# EAGLE design NanoPi_NEO_Adapter_V1.0 (EAGLE 6.6.0)
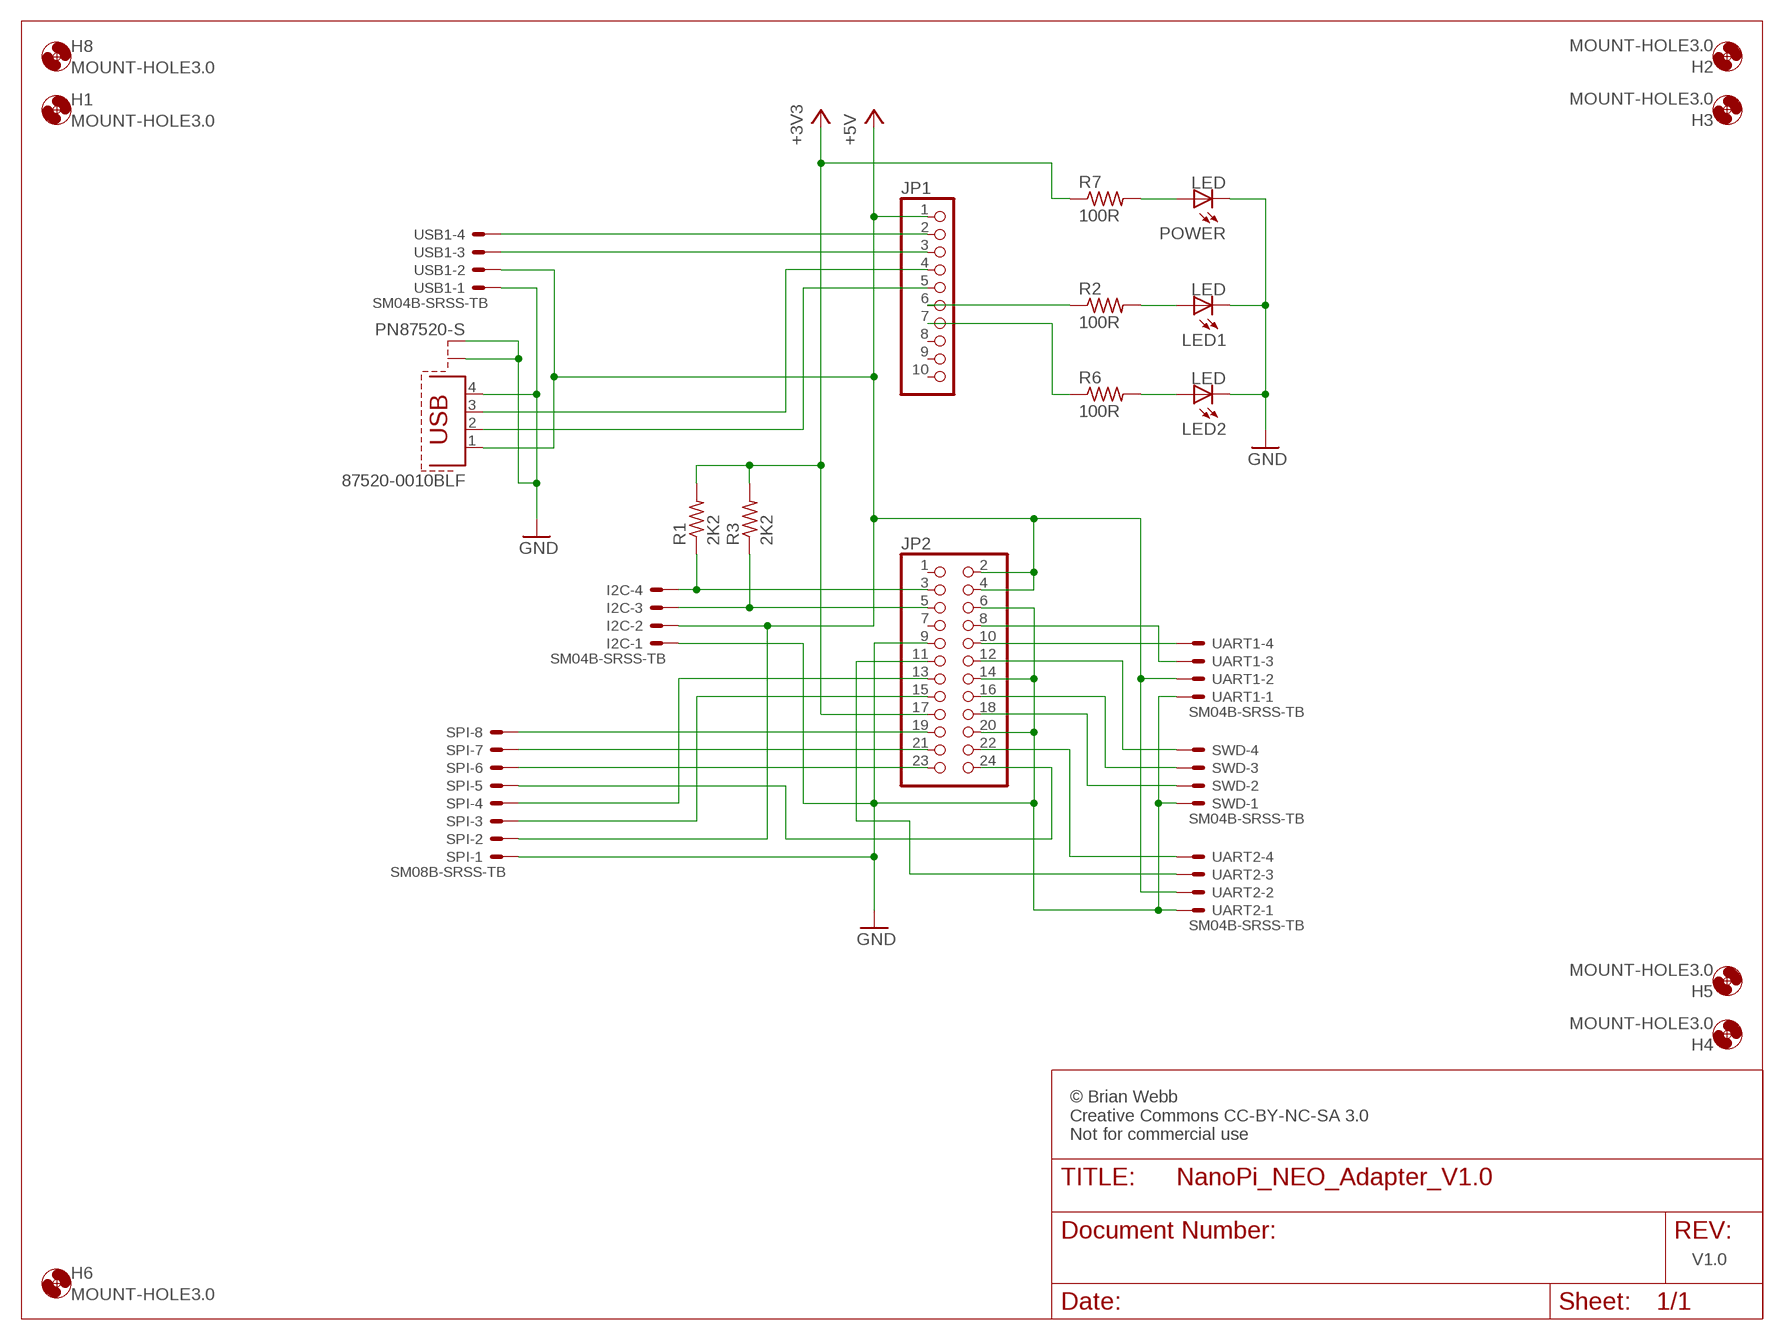
[diagram p0: schematic, sheet 1]

## Parts
87520-0010BLF  PN87520-S  [PN87520-S]
H1  MOUNT-HOLE3.0  [3,0]
H2  MOUNT-HOLE3.0  [3,0]
H3  MOUNT-HOLE3.0  [3,0]
H4  MOUNT-HOLE3.0  [3,0]
H5  MOUNT-HOLE3.0  [3,0]
H6  MOUNT-HOLE3.0  [3,0]
H8  MOUNT-HOLE3.0  [3,0]
I2C  SM04B-SRSS-TB  [SM04B-SRSS-TB]
JP1  PINHD-1X10  [1X10]
JP2  PINHD-2X12  [2X12]
LED1  LED  LED_0402  [LED0402]
LED2  LED  LED_0402  [LED0402]
POWER  LED  LED_0402  [LED0402]
R1  2K2  R-US_R0402  [R0402]
R2  100R  R-US_R0402  [R0402]
R3  2K2  R-US_R0402  [R0402]
R6  100R  R-US_R0402  [R0402]
R7  100R  R-US_R0402  [R0402]
SPI  SM08B-SRSS-TB  [SM08B-SRSS-TB]
SWD  SM04B-SRSS-TB  [SM04B-SRSS-TB]
UART1  SM04B-SRSS-TB  [SM04B-SRSS-TB]
UART2  SM04B-SRSS-TB  [SM04B-SRSS-TB]
USB1  SM04B-SRSS-TB  [SM04B-SRSS-TB]

## Nets
+3V3: JP2.17 R1.2 R3.2 R7.1
+5V: 87520-0010BLF.1 I2C.2 JP1.1 JP2.2 JP2.4 SPI.2 UART1.2 UART2.2 USB1.2
GND: 87520-0010BLF.4 87520-0010BLF.S1 87520-0010BLF.S2 I2C.1 JP2.6 JP2.9 JP2.14 JP2.20 LED1.C LED2.C POWER.C SPI.1 SWD.1 UART1.1 UART2.1 USB1.1
N$1: JP1.2 USB1.4
N$2: JP1.3 USB1.3
N$3: JP2.10 UART1.4
N$4: JP2.8 UART1.3
N$5: 87520-0010BLF.3 JP1.4
N$6: 87520-0010BLF.2 JP1.5
N$7: JP2.19 SPI.8
N$8: JP2.22 UART2.4
N$9: JP2.18 SWD.2
N$10: I2C.4 JP2.3 R1.1
N$11: I2C.3 JP2.5 R3.1
N$12: JP2.21 SPI.7
N$13: JP2.23 SPI.6
N$14: JP2.24 SPI.5
N$15: JP2.13 SPI.4
N$16: JP2.15 SPI.3
N$17: LED2.A R6.2
N$18: LED1.A R2.2
N$19: POWER.A R7.2
N$20: JP2.11 UART2.3
N$21: JP1.6 R2.1
N$22: JP1.7 R6.1
N$23: JP2.16 SWD.3
N$24: JP2.12 SWD.4
Unconnected: JP1.8 JP1.9 JP1.10 JP2.1 JP2.7

## Notes on the sheet
- © Brian Webb
  Creative Commons CC-BY-NC-SA 3.0
  Not for commercial use
- V1.0

## Library data of the parts
87520-0010BLF = con-berg:PN87520-S; OC_FARNELL: unknown; OC_NEWARK: unknown
H1-H6 H8 = webb:MOUNT-HOLE: MOUNTING HOLE with drill center marker
I2C SWD UART1 UART2 USB1 = con-jst2:?M04B-SRSS-TB: Disconnectable Crimp style connector, 1.0mm pitch 4 contacts
JP1 = pinhead:PINHD-1X10: PIN HEADER
JP2 = pinhead:PINHD-2X12: PIN HEADER
LED1 LED2 POWER = webb:LED_0402
R1-R3 R6 R7 = rcl:R-US_: RESISTOR, American symbol; PARTNO: ERJ-2GEJ222X
SPI = con-jst2:?M08B-SRSS-TB: Disconnectable Crimp style connector, 1.0mm pitch 8 contacts

## Net classes
0 default: width 0.152 mm, clearance 0.152 mm
1 power: width 0.254 mm, clearance 0.152 mm

## Board
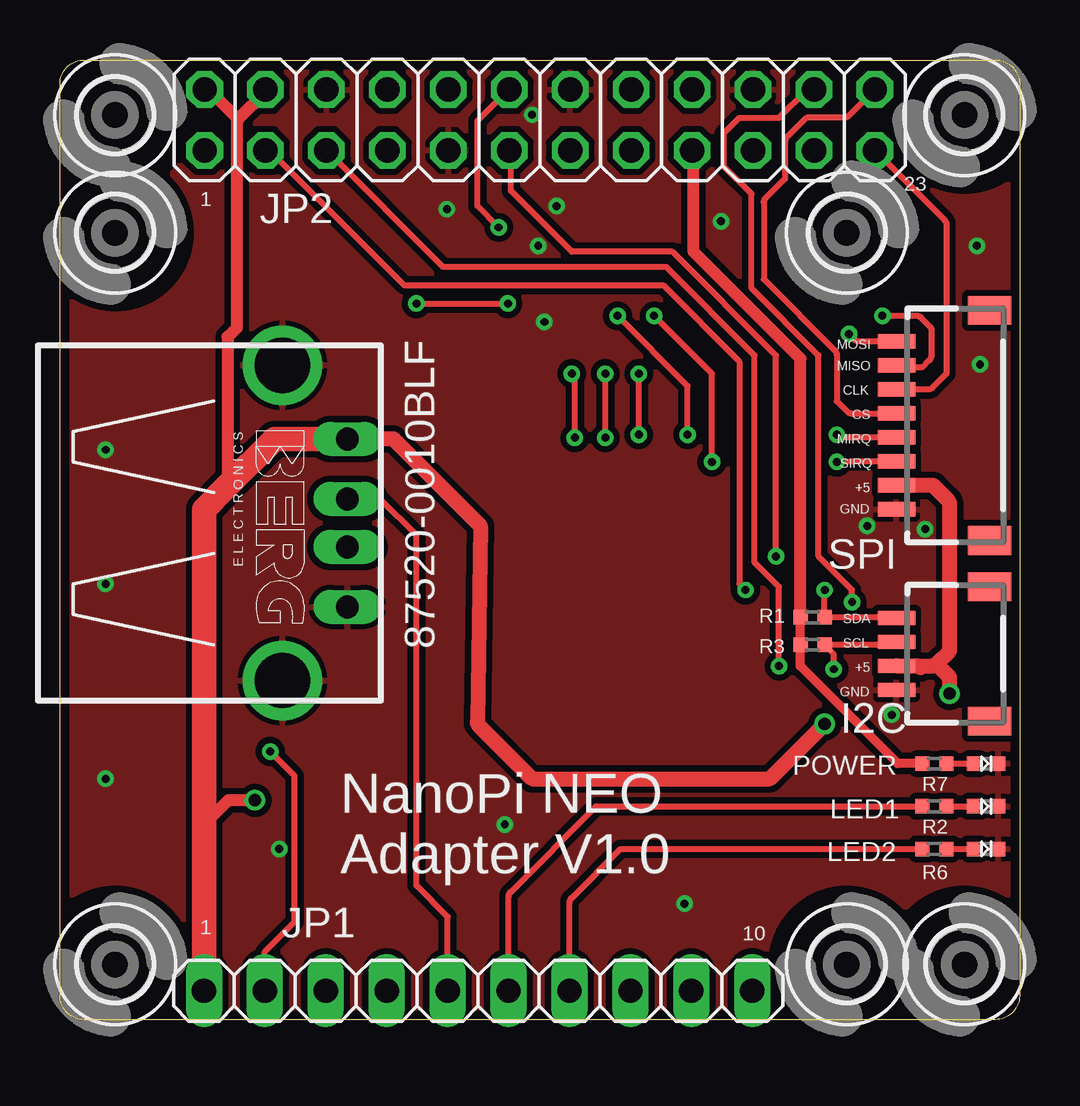
[diagram p1: board, top side]
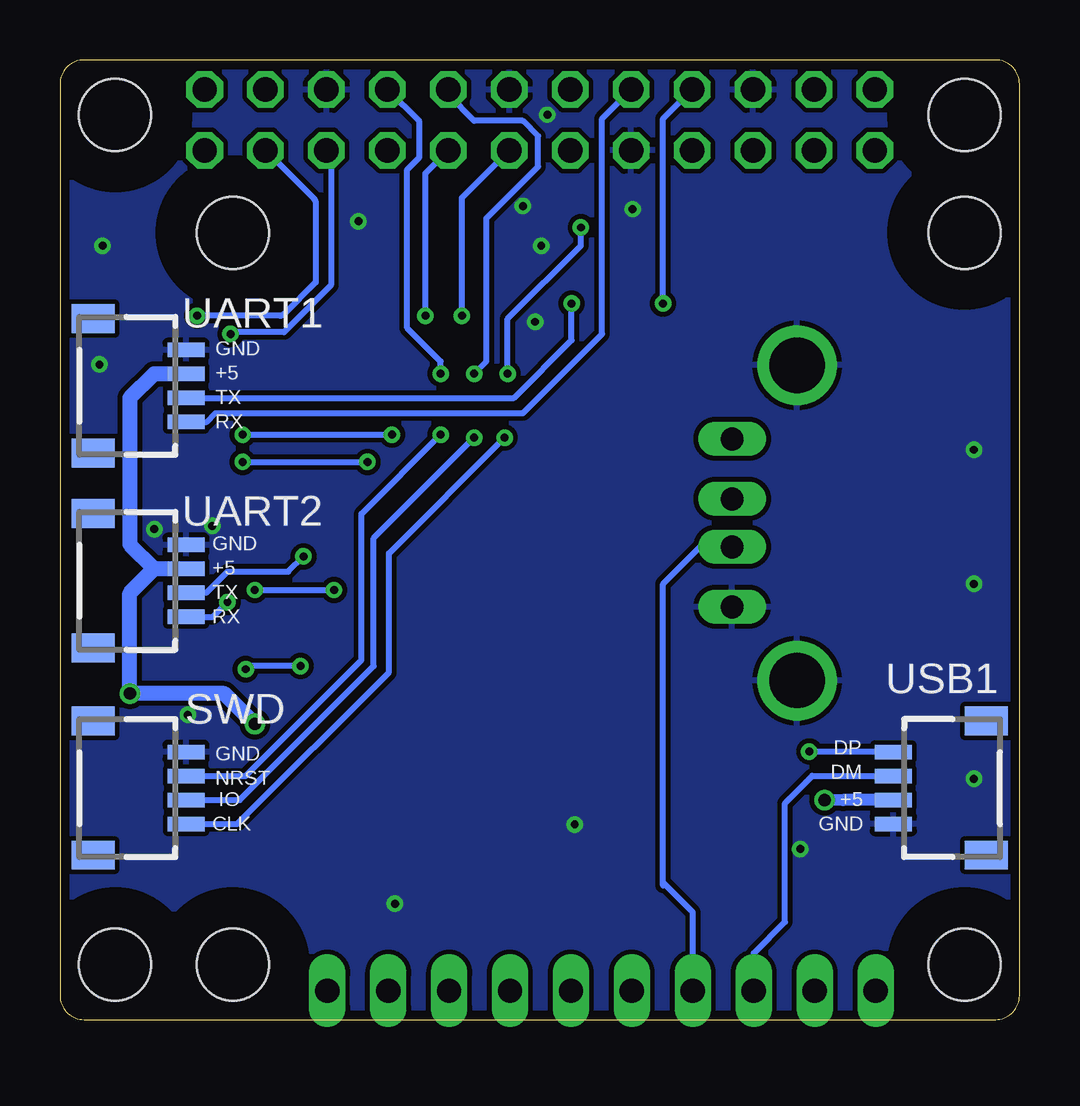
[diagram p2: board, bottom side, seen from below]

Size 40 x 40 mm. Coordinates in mm from the lower left corner, seen from the top.
Outline: 0,1 0,39 arc-90 1,40 39,40 arc-90 40,39 40,1 arc-90 39,0 1,0 arc-90 0,1
Copper layers (1*16): Top 0.0356mm / dielectric 1.5011mm / Bottom 0.0356mm
Design rules "LaenPCBOrder *": minimum track width 6mil, minimum drill 13mil, track to track 6mil, track to pad 6mil, pad to pad 6mil, via to via 6mil, smd to smd 6mil, copper to edge 15mil, drill to drill 6mil, minimum pad ring 7mil, minimum via ring 7mil, stop-mask expansion 4mil, vias tented up to drill 30mil, thermal gap 8mil

### Footprints (pad centres in the part's own frame; a part is rotated, then mirrored left to right if it is on the bottom)
PN87520-S = drill 0.95 long: 1 -3.5,2.71; 2 -1,2.71; 3 1,2.71; 4 3.5,2.71 | drill 2.3 pad 2.9: S1 -6.57,0; S2 6.57,0
3,0 = hole 3: 0,0
SM04B-SRSS-TB = smd 0.6 x 1.55: 1 -1.5,2.975; 2 -0.5,2.975; 3 0.5,2.975; 4 1.5,2.975 | smd 1.2 x 1.8: FIT@1 -2.8,-0.9; FIT@2 2.8,-0.9
1X10 = drill 1.016 long: 1 -11.43,0; 2 -8.89,0; 3 -6.35,0; 4 -3.81,0; 5 -1.27,0; 6 1.27,0; 7 3.81,0; 8 6.35,0; 9 8.89,0; 10 11.43,0
2X12 = drill 1.016 octagon: 1 -13.97,-1.27; 2 -13.97,1.27; 3 -11.43,-1.27; 4 -11.43,1.27; 5 -8.89,-1.27; 6 -8.89,1.27; 7 -6.35,-1.27; 8 -6.35,1.27; 9 -3.81,-1.27; 10 -3.81,1.27; 11 -1.27,-1.27; 12 -1.27,1.27; 13 1.27,-1.27; 14 1.27,1.27; 15 3.81,-1.27; 16 3.81,1.27; 17 6.35,-1.27; 18 6.35,1.27; 19 8.89,-1.27; 20 8.89,1.27; 21 11.43,-1.27; 22 11.43,1.27; 23 13.97,-1.27; 24 13.97,1.27
LED0402 = smd 0.6 x 0.6: A -0.5,0; C 0.5,0
R0402 = smd 0.6 x 0.6: 1 -0.5,0; 2 0.5,0
SM08B-SRSS-TB = smd 0.6 x 1.55: 1 -3.5,2.975; 2 -2.5,2.975; 3 -1.5,2.975; 4 -0.5,2.975; 5 0.5,2.975; 6 1.5,2.975; 7 2.5,2.975; 8 3.5,2.975 | smd 1.2 x 1.8: FIT@1 -4.8,-0.9; FIT@2 4.8,-0.9

### Placement (x,y rotation side)
87520-0010BLF  9.27,20.7 270 top
H1  2.3,32.8 0 top
H2  37.7,37.7 0 top
H3  32.8,32.8 0 top
H4  37.7,2.3 0 top
H5  32.8,2.3 0 top
H6  2.3,2.3 0 top
H8  2.3,37.7 0 top
I2C  37.85,15.24 90 top
JP1  17.43,1.2 0 top
JP2  20,37.5 0 top
LED1  38.61,8.89 0 top
LED2  38.61,7.11 0 top
POWER  38.61,10.67 0 top
R1  31.37,16.76 180 top
R2  36.45,8.89 0 top
R3  31.37,15.62 180 top
R6  36.45,7.11 0 top
R7  36.45,10.67 0 top
SPI  37.85,24.77 90 top
SWD  37.72,9.65 270 bottom
UART1  37.72,26.42 270 bottom
UART2  37.72,18.29 270 bottom
USB1  2.29,9.65 90 bottom

### Tracks (layer width: path | path; a pad name or v marks a point on that pad's centre or on a via)
+3V3
  Top 0.381: R1.2 R3.2 30.86,14.73 34.92,10.67 R7.1
  Top 0.508: JP2.17 26.42,36.16 26.42,32 30.87,27.55 R1.2
+5V  (via drill 0.51)
  Top 0.508: 6.91,22.17 6.99,22.25 6.99,28.45 7.37,28.83 7.37,37.46 7.43,37.53 | v8.13,9.14 7.02,9.14 6,8.13 | JP2.4 8.57,38.66 7.43,37.53 | JP2.2 6.19,38.77 7.43,37.53
  Top 0.635: 36.53,14.81 arc-45 36.35,14.74 I2C.2 35.7,14.74 arc-45 35.88,14.67 | 36.53,14.81 37.08,15.37 37.08,21.48 arc45 37.01,21.66 36.45,22.23 arc45 36.35,22.27 SPI.2 | v37.08,13.59 37.08,14.26 36.53,14.81 | 87520-0010BLF.1 13.9,24.2 17.53,20.57 17.4,12.42 arc45 17.47,12.24 19.68,10.03 29.59,10.03 v31.88,12.32
  Top 1.016: JP1.1 6,8.13 6,21.26 6.91,22.17 8.94,24.2 87520-0010BLF.1
  Bottom 0.508: USB1.2 7.36,9.15 v8.13,9.14
  Bottom 0.635: 36.07,18.8 37.08,17.78 v37.08,13.59 33.15,13.59 v31.88,12.32 | 36.07,18.8 34.75,18.8 UART2.2 | UART1.2 36.08,26.92 37.08,25.91 37.08,19.81 36.07,18.8
GND  (via drill 0.33)
  other vias: 1.91,23.75 1.91,18.16 1.91,10.03 9.14,7.11 18.54,8.13 36.07,20.45 34.67,12.7 33.66,20.57 26.04,4.83 38.23,32.26 27.56,33.27 38.35,27.3 20.19,29.08 20.7,33.91 19.68,37.72 16.13,33.78 19.94,32.26
  pour Bottom (isolate 0.2): 0,40 40,40 40,0 0,0
  pour Top (isolate 0.254): 0,0 40,0 40,40 0,40 0.1,17.9
N$1  (via drill 0.33)
  Top 0.254: JP1.2 8.54,2.83 9.78,4.06 9.78,10.16 v8.76,11.18
  Bottom 0.254: v8.76,11.18 5.29,11.18 USB1.4
N$2
  Bottom 0.254: JP1.3 11.08,2.76 9.78,4.06 9.78,9.02 8.64,10.16 USB1.3
N$3
  Bottom 0.254: UART1.4 33.88,24.92 33.53,25.27 20.7,25.27 17.4,28.57 17.4,37.56 JP2.10
N$4  (via drill 0.33)
  Top 0.254: v14.86,29.84 v18.67,29.84
  Bottom 0.254: UART1.3 21.07,25.92 18.67,28.32 v18.67,29.84 | JP2.8 14.86,37.56 v14.86,29.84
N$5
  Bottom 0.254: 14.86,5.59 14.86,5.71 | 14.86,5.71 14.86,18.16 13.32,19.7 87520-0010BLF.3 | JP1.4 13.62,4.48 14.86,5.71
N$6
  Top 0.254: JP1.5 16.16,4.29 14.86,5.59 14.86,20.19 13.35,21.7 87520-0010BLF.2
N$7  (via drill 0.33)
  Top 0.254: SPI.8 33.31,28.27 arc-45 33.13,28.34 v32.89,28.57
  Bottom 0.254: JP2.19 28.78,36.12 arc45 28.7,35.94 28.7,30.61 30.66,28.65 32.71,28.65 arc-45 v32.89,28.57
N$8  (via drill 0.33)
  Top 0.254: JP2.22 31.15,38.77 29.97,37.59 28.32,37.59 27.69,36.96 27.69,35.56 28.83,34.42 28.83,30.48 31.62,27.69 31.62,19.3 33.02,17.91 v33.02,17.4
  Bottom 0.254: UART2.4 33.63,16.79 v33.02,17.4
N$9  (via drill 0.33)
  Top 0.254: v24.13,24.38 v24.13,26.92
  Bottom 0.254: SWD.2 32.27,10.15 27.43,14.99 27.43,21.08 v24.13,24.38 | v24.13,26.92 24.13,27.43 25.53,28.83 25.53,35.43 25.02,35.94 25.02,37.44 JP2.18
N$10  (via drill 0.33)
  Top 0.254: I2C.4 arc45 34.81,16.76 R1.1 v31.87,17.9 v31.88,17.91 | JP2.3 8.62,36.23 arc-45 8.8,36.16 14.35,30.61 25.15,30.61 28.32,27.43 28.32,18.16 v28.57,17.91
  Bottom 0.254: v31.88,17.91 v28.57,17.91
N$11  (via drill 0.33)
  Top 0.254: I2C.3 34.83,15.7 arc-45 34.65,15.62 R3.1 32.26,15.23 v32.26,14.61 | JP2.5 15.97,31.37 25.27,31.37 28.96,27.69 28.96,19.05 29.97,18.03 v29.97,14.73
  Bottom 0.254: v29.97,14.73 32.13,14.73 v32.26,14.61
N$12  (via drill 0.33)
  Top 0.254: v34.29,29.34 35.71,29.34 arc-45 35.89,29.26 36.32,28.83 36.32,27.66 arc-45 36.25,27.48 35.94,27.18 35.06,27.18 arc-45 34.88,27.25 SPI.7
  Bottom 0.254: JP2.21 29.41,34.21 arc45 29.34,34.03 29.34,30.73 30.66,29.41 arc45 30.84,29.34 v34.29,29.34
N$13
  Top 0.254: JP2.23 36.88,33.32 arc-45 36.96,33.14 36.96,26.92 36.37,26.34 arc-45 36.19,26.27 SPI.6
N$14
  Top 0.254: JP2.24 32.87,37.67 arc-45 32.69,37.59 31.11,37.59 30.3,36.78 arc45 30.23,36.6 30.23,35.05 29.41,34.24 arc45 29.34,34.06 29.34,30.86 32.31,27.89 arc-45 32.38,27.71 32.38,25.78 32.83,25.34 arc45 33.01,25.27 SPI.5
N$15  (via drill 0.33)
  Top 0.254: SPI.4 32.63,24.27 v32.38,24.38 | v26.16,24.38 26.16,26.42 v23.24,29.34
  Bottom 0.254: v32.38,24.38 v26.16,24.38 | v23.24,29.34 23.24,34.26 JP2.13
N$16  (via drill 0.33)
  Top 0.254: SPI.3 33.04,23.27 v32.38,23.24 | v27.18,23.24 27.18,26.92 v24.77,29.34
  Bottom 0.254: v32.38,23.24 v27.18,23.24 | v24.77,29.34 24.77,35.27 JP2.15
N$17
  Top 0.254: R6.2 LED2.A
N$18
  Top 0.254: R2.2 LED1.A
N$19
  Top 0.254: R7.2 POWER.A
N$20  (via drill 0.33)
  Top 0.254: v29.84,19.3 29.84,27.69 25.53,32 21.34,32 18.8,34.54 18.8,36.16 JP2.11
  Bottom 0.254: v29.84,19.3 30.48,18.67 33.02,18.67 33.9,17.79 UART2.3
N$21
  Top 0.254: JP1.6 18.7,5.13 arc-45 18.77,5.31 22.35,8.89 R2.1
N$22
  Top 0.254: JP1.7 21.24,4.88 arc-45 21.31,5.06 23.37,7.11 R6.1
N$23  (via drill 0.33)
  Top 0.254: v22.73,24.26 v22.73,26.92
  Bottom 0.254: SWD.3 32.5,9.15 26.92,14.73 26.92,20.07 v22.73,24.26 | v22.73,26.92 22.23,27.43 22.23,33.4 20.07,35.56 20.07,36.83 20.7,37.47 22.73,37.47 23.81,38.54 JP2.16
N$24  (via drill 0.33)
  Top 0.254: v21.46,24.26 21.46,26.8 v21.34,26.92 | v18.29,33.02 17.4,33.91 17.4,37.47 18.7,38.77 JP2.12
  Bottom 0.254: SWD.4 32.62,8.15 26.29,14.48 26.29,19.43 v21.46,24.26 | v21.34,26.92 21.34,29.21 18.29,32.26 v18.29,33.02

### Text on the board
tNames: 23 | 1 | MOSI | MISO | CLK | CS | MIRQ | SIRQ | +5 | GND | SDA | SCL | +5 | GND | NanoPi NEO / Adapter V1.0 | 1 | 10
bNames: GND | +5 | TX | RX | GND | +5 | TX | RX | DP | GND | DM | NRST | +5 | IO | GND | CLK
bDocu: 3.3V | B0